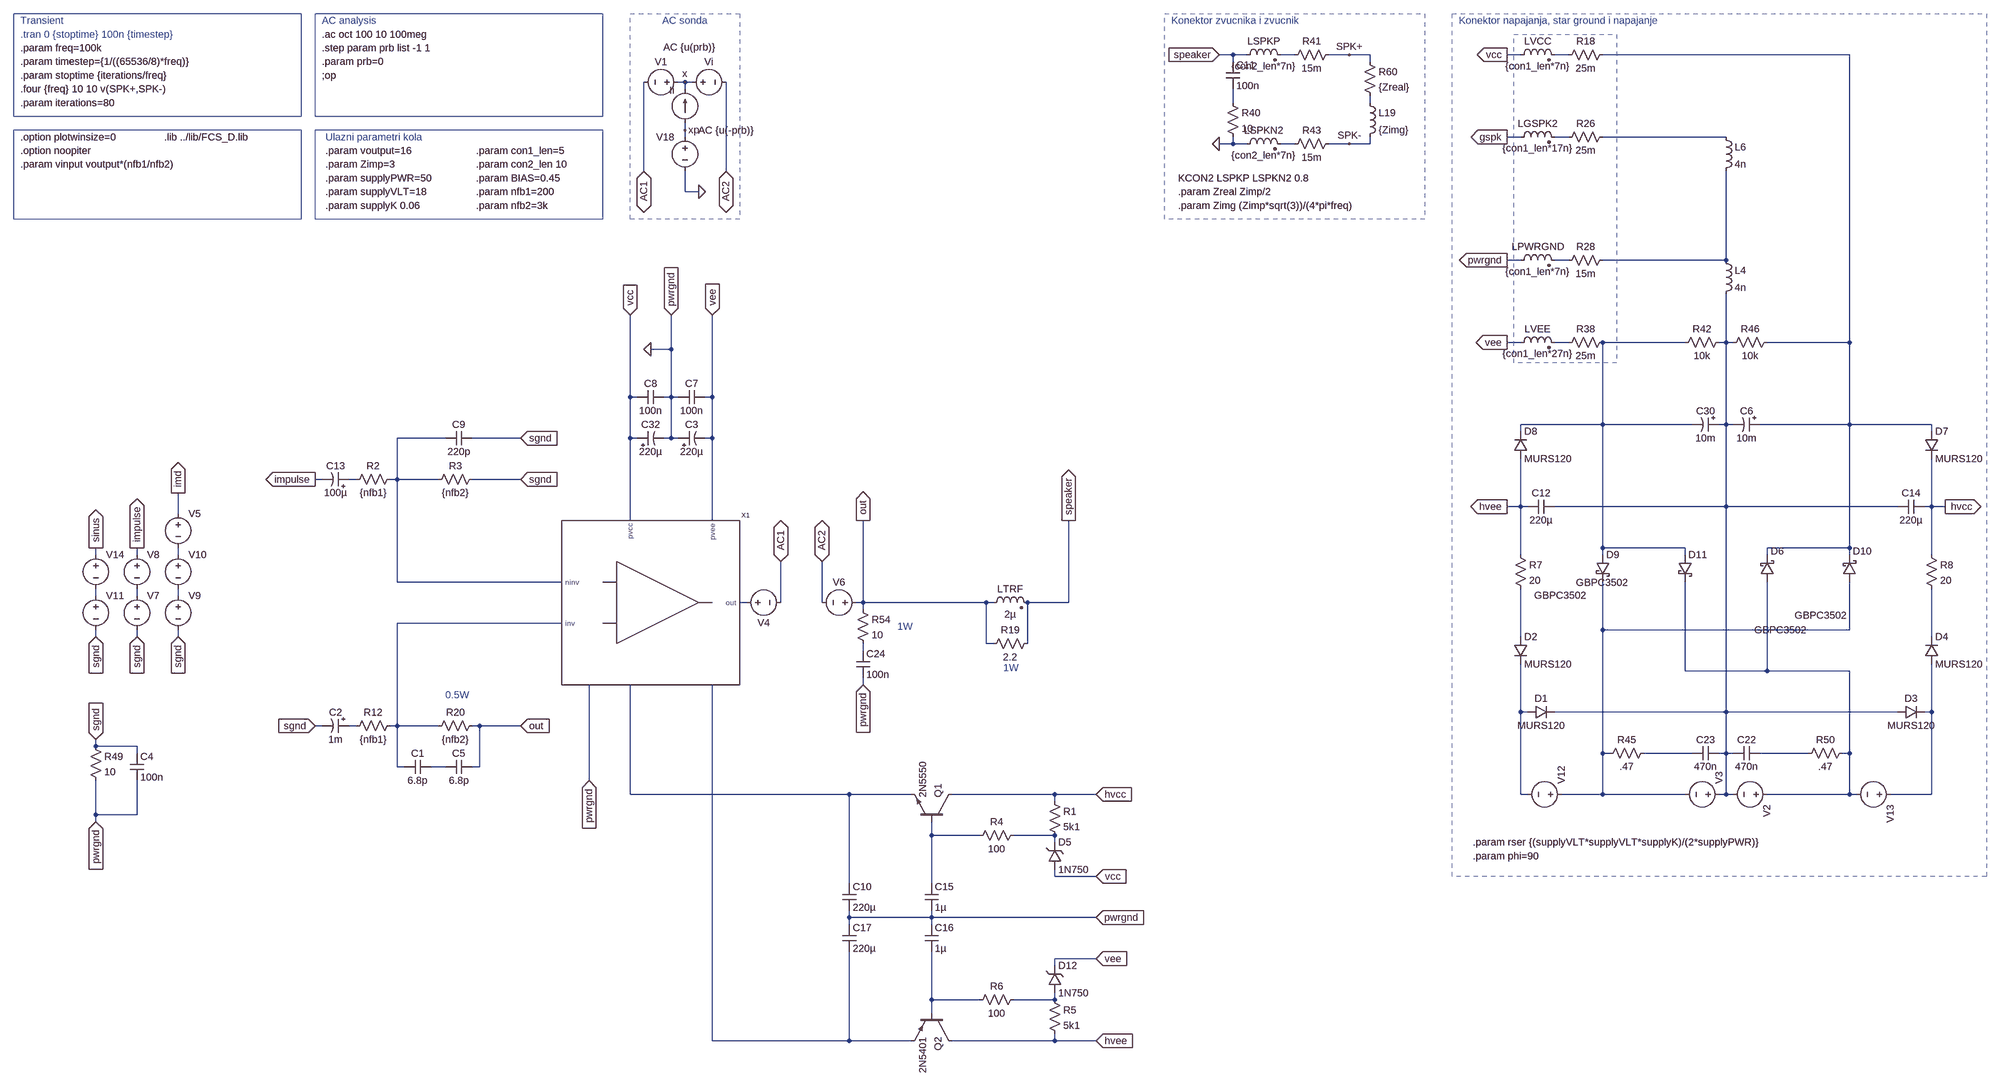
[diagram p0: schematic pab3bbb-compact.asc]
pab3bbb-compact.asc, the LTspice schematic file:
Version 4
SHEET 1 6124 2336
WIRE 2272 -1536 2240 -1536
WIRE 2304 -1536 2272 -1536
WIRE 2416 -1536 2384 -1536
WIRE 2544 -1536 2496 -1536
WIRE 2592 -1536 2544 -1536
WIRE 2944 -1536 2912 -1536
WIRE 3056 -1536 3024 -1536
WIRE 3712 -1536 3136 -1536
WIRE 2272 -1520 2272 -1536
WIRE 2592 -1520 2592 -1536
WIRE 992 -1472 976 -1472
WIRE 1008 -1472 992 -1472
WIRE 992 -1456 992 -1472
WIRE 2272 -1424 2272 -1456
WIRE 2592 -1424 2592 -1440
WIRE 992 -1360 992 -1376
WIRE 992 -1344 992 -1360
WIRE 2944 -1344 2912 -1344
WIRE 3056 -1344 3024 -1344
WIRE 3424 -1344 3136 -1344
WIRE 2272 -1328 2272 -1344
WIRE 2272 -1328 2240 -1328
WIRE 2304 -1328 2272 -1328
WIRE 2416 -1328 2384 -1328
WIRE 2544 -1328 2496 -1328
WIRE 2592 -1328 2592 -1344
WIRE 2592 -1328 2544 -1328
WIRE 896 -1264 896 -1472
WIRE 1088 -1264 1088 -1472
WIRE 992 -1216 992 -1264
WIRE 1024 -1216 992 -1216
WIRE 2944 -1056 2912 -1056
WIRE 3056 -1056 3024 -1056
WIRE 3424 -1056 3424 -1264
WIRE 3424 -1056 3136 -1056
WIRE 2944 -864 2912 -864
WIRE 3056 -864 3024 -864
WIRE 3328 -864 3136 -864
WIRE 3424 -864 3424 -976
WIRE 3424 -864 3408 -864
WIRE 3440 -864 3424 -864
WIRE 3712 -864 3712 -1536
WIRE 3712 -864 3520 -864
WIRE 960 -848 960 -928
WIRE 960 -848 912 -848
WIRE 864 -736 864 -928
WIRE 880 -736 864 -736
WIRE 960 -736 960 -848
WIRE 960 -736 944 -736
WIRE 976 -736 960 -736
WIRE 1056 -736 1056 -928
WIRE 1056 -736 1040 -736
WIRE 3136 -672 3136 -864
WIRE 3136 -672 2944 -672
WIRE 3344 -672 3136 -672
WIRE 3424 -672 3424 -864
WIRE 3424 -672 3408 -672
WIRE 3440 -672 3424 -672
WIRE 3712 -672 3712 -864
WIRE 3712 -672 3504 -672
WIRE 3904 -672 3712 -672
WIRE 2944 -656 2944 -672
WIRE 3904 -656 3904 -672
WIRE 432 -640 320 -640
WIRE 608 -640 496 -640
WIRE 864 -640 864 -736
WIRE 880 -640 864 -640
WIRE 960 -640 960 -736
WIRE 960 -640 944 -640
WIRE 976 -640 960 -640
WIRE 1056 -640 1056 -736
WIRE 1056 -640 1040 -640
WIRE 144 -544 128 -544
WIRE 224 -544 208 -544
WIRE 320 -544 320 -640
WIRE 320 -544 304 -544
WIRE 416 -544 320 -544
WIRE 608 -544 496 -544
WIRE 2944 -480 2944 -592
WIRE 2944 -480 2912 -480
WIRE 2960 -480 2944 -480
WIRE 3424 -480 3424 -672
WIRE 3424 -480 3024 -480
WIRE 3824 -480 3424 -480
WIRE 3904 -480 3904 -592
WIRE 3904 -480 3888 -480
WIRE 3936 -480 3904 -480
WIRE -192 -464 -192 -512
WIRE 864 -448 864 -640
WIRE 1056 -448 1056 -640
WIRE 3136 -384 3136 -672
WIRE 3328 -384 3136 -384
WIRE 3712 -384 3712 -672
WIRE 3712 -384 3520 -384
WIRE -384 -368 -384 -384
WIRE -288 -368 -288 -384
WIRE -192 -368 -192 -384
WIRE 2944 -368 2944 -480
WIRE 3136 -368 3136 -384
WIRE 3328 -368 3328 -384
WIRE 3520 -368 3520 -384
WIRE 3712 -368 3712 -384
WIRE 3904 -368 3904 -480
WIRE 320 -304 320 -544
WIRE 704 -304 320 -304
WIRE -384 -272 -384 -288
WIRE -288 -272 -288 -288
WIRE -192 -272 -192 -288
WIRE 1136 -256 1120 -256
WIRE 1216 -256 1216 -352
WIRE 1312 -256 1312 -352
WIRE 1408 -256 1408 -448
WIRE 1408 -256 1392 -256
WIRE 1696 -256 1408 -256
WIRE 1712 -256 1696 -256
WIRE 1888 -256 1888 -448
WIRE 1888 -256 1792 -256
WIRE 1408 -240 1408 -256
WIRE 704 -208 320 -208
WIRE 3136 -192 3136 -304
WIRE 3712 -192 3712 -304
WIRE 3712 -192 3136 -192
WIRE -384 -176 -384 -192
WIRE -288 -176 -288 -192
WIRE -192 -176 -192 -192
WIRE 2944 -176 2944 -288
WIRE 3904 -176 3904 -288
WIRE 1696 -160 1696 -256
WIRE 1712 -160 1696 -160
WIRE 1792 -160 1792 -256
WIRE 1408 -144 1408 -160
WIRE 3328 -96 3328 -304
WIRE 3520 -96 3520 -304
WIRE 3520 -96 3328 -96
WIRE 3712 -96 3520 -96
WIRE 1408 -64 1408 -80
WIRE 2944 0 2944 -112
WIRE 2960 0 2944 0
WIRE 3424 0 3424 -480
WIRE 3424 0 3024 0
WIRE 3824 0 3424 0
WIRE 3904 0 3904 -112
WIRE 3904 0 3888 0
WIRE 144 32 128 32
WIRE 224 32 208 32
WIRE 320 32 320 -208
WIRE 320 32 304 32
WIRE 416 32 320 32
WIRE 512 32 496 32
WIRE 608 32 512 32
WIRE -384 80 -384 64
WIRE -288 80 -384 80
WIRE -288 96 -288 80
WIRE 3136 96 3136 -192
WIRE 3152 96 3136 96
WIRE 3344 96 3232 96
WIRE 3424 96 3424 0
WIRE 3424 96 3408 96
WIRE 3440 96 3424 96
WIRE 3616 96 3504 96
WIRE 3712 96 3712 -96
WIRE 3712 96 3696 96
WIRE 320 128 320 32
WIRE 336 128 320 128
WIRE 432 128 400 128
WIRE 512 128 512 32
WIRE 512 128 496 128
WIRE 768 160 768 -64
WIRE 864 192 864 -64
WIRE 1376 192 864 192
WIRE 1520 192 1376 192
WIRE 1856 192 1616 192
WIRE 1952 192 1856 192
WIRE 2944 192 2944 0
WIRE 2960 192 2944 192
WIRE 3136 192 3136 96
WIRE 3136 192 3040 192
WIRE 3328 192 3136 192
WIRE 3424 192 3424 96
WIRE 3424 192 3408 192
WIRE 3440 192 3424 192
WIRE 3712 192 3712 96
WIRE 3712 192 3520 192
WIRE 3728 192 3712 192
WIRE 3904 192 3904 0
WIRE 3904 192 3808 192
WIRE 1856 208 1856 192
WIRE -384 240 -384 160
WIRE -288 240 -288 160
WIRE -288 240 -384 240
WIRE -384 256 -384 240
WIRE 1568 288 1568 256
WIRE 1680 288 1568 288
WIRE 1856 288 1760 288
WIRE 1856 304 1856 288
WIRE 1856 384 1856 368
WIRE 1952 384 1856 384
WIRE 1376 400 1376 192
WIRE 1568 400 1568 288
WIRE 1376 480 1376 464
WIRE 1568 480 1568 464
WIRE 1568 480 1376 480
WIRE 1952 480 1568 480
WIRE 1376 496 1376 480
WIRE 1568 496 1568 480
WIRE 1952 576 1856 576
WIRE 1856 592 1856 576
WIRE 1568 672 1568 560
WIRE 1680 672 1568 672
WIRE 1856 672 1856 656
WIRE 1856 672 1760 672
WIRE 1568 704 1568 672
WIRE 1056 768 1056 -64
WIRE 1376 768 1376 560
WIRE 1376 768 1056 768
WIRE 1520 768 1376 768
WIRE 1856 768 1856 752
WIRE 1856 768 1616 768
WIRE 1952 768 1856 768
FLAG 992 -1472 x
FLAG 1408 -448 out
IOPIN 1408 -448 Out
FLAG 992 -1360 xp
FLAG 1408 -64 pwrgnd
IOPIN 1408 -64 In
FLAG 128 32 sgnd
IOPIN 128 32 In
FLAG -384 -176 sgnd
IOPIN -384 -176 In
FLAG -384 -384 sinus
IOPIN -384 -384 Out
FLAG 2912 -1536 vcc
IOPIN 2912 -1536 Out
FLAG 2912 -864 vee
IOPIN 2912 -864 Out
FLAG 2912 -1344 gspk
IOPIN 2912 -1344 Out
FLAG 2912 -1056 pwrgnd
IOPIN 2912 -1056 Out
FLAG 608 32 out
IOPIN 608 32 In
FLAG 1888 -448 speaker
IOPIN 1888 -448 Out
FLAG 2240 -1536 speaker
IOPIN 2240 -1536 In
FLAG -288 -384 impulse
IOPIN -288 -384 Out
FLAG 896 -1264 AC1
IOPIN 896 -1264 BiDir
FLAG 1088 -1264 AC2
IOPIN 1088 -1264 BiDir
FLAG 1216 -352 AC1
IOPIN 1216 -352 BiDir
FLAG 1312 -352 AC2
IOPIN 1312 -352 BiDir
FLAG 2544 -1536 SPK+
FLAG 2544 -1328 SPK-
FLAG -192 -512 imd
IOPIN -192 -512 Out
FLAG -288 -176 sgnd
IOPIN -288 -176 In
FLAG -192 -176 sgnd
IOPIN -192 -176 In
FLAG -384 64 sgnd
IOPIN -384 64 In
FLAG 1056 -928 vee
IOPIN 1056 -928 In
FLAG 864 -928 vcc
IOPIN 864 -928 In
FLAG 960 -928 pwrgnd
IOPIN 960 -928 In
FLAG 1024 -1216 0
FLAG 768 160 pwrgnd
IOPIN 768 160 In
FLAG -384 256 pwrgnd
IOPIN -384 256 In
FLAG 912 -848 0
FLAG 608 -544 sgnd
IOPIN 608 -544 In
FLAG 2240 -1328 0
FLAG 608 -640 sgnd
IOPIN 608 -640 In
FLAG 2912 -480 hvee
IOPIN 2912 -480 Out
FLAG 3936 -480 hvcc
IOPIN 3936 -480 Out
FLAG 1952 192 hvcc
IOPIN 1952 192 In
FLAG 1952 384 vcc
IOPIN 1952 384 In
FLAG 1952 480 pwrgnd
IOPIN 1952 480 In
FLAG 1952 576 vee
IOPIN 1952 576 In
FLAG 1952 768 hvee
IOPIN 1952 768 In
FLAG 128 -544 impulse
IOPIN 128 -544 Out
SYMBOL res 320 16 R90
WINDOW 0 0 56 VBottom 2
WINDOW 3 32 56 VTop 2
SYMATTR InstName R12
SYMATTR Value {nfb1}
SYMBOL voltage 3536 192 R90
WINDOW 123 0 0 Left 2
WINDOW 3 -94 177 Invisible 2
SYMATTR Value SINE(0 {supplyVLT*sqrt(2)} 50 1m 0 {phi})
SYMATTR SpiceLine Rser={rser}
SYMATTR InstName V2
SYMBOL current 992 -1376 R180
WINDOW 0 24 77 Left 2
WINDOW 3 24 0 Invisible 2
WINDOW 123 -71 178 Left 2
WINDOW 39 0 0 Left 2
SYMATTR InstName Ii
SYMATTR Value 0
SYMATTR Value2 AC {u(prb)}
SYMBOL voltage 992 -1472 R270
WINDOW 0 32 56 VTop 2
WINDOW 3 -32 56 Invisible 2
WINDOW 123 -97 96 VBottom 2
WINDOW 39 -32 56 VBottom 2
SYMATTR InstName Vi
SYMATTR Value 0
SYMATTR Value2 AC {u(-prb)}
SYMBOL ind2 1696 -240 R270
WINDOW 0 32 56 VTop 2
WINDOW 3 4 56 VBottom 2
SYMATTR InstName LTRF
SYMATTR Value 2µ
SYMATTR SpiceLine Rser=10m Rpar=3meg Cpar=1p
SYMATTR Type ind
SYMBOL res 1696 -144 R270
WINDOW 0 32 56 VTop 2
WINDOW 3 0 56 VBottom 2
SYMATTR InstName R19
SYMATTR Value 2.2
SYMBOL res 512 16 R90
WINDOW 0 0 56 VBottom 2
WINDOW 3 32 56 VTop 2
SYMATTR InstName R20
SYMATTR Value {nfb2}
SYMBOL voltage 992 -1472 R90
WINDOW 0 -32 56 VBottom 2
WINDOW 3 32 56 Invisible 2
WINDOW 123 0 0 Left 2
WINDOW 39 0 0 Left 2
SYMATTR InstName V1
SYMATTR Value 0
SYMBOL schottky 3504 -304 M180
WINDOW 0 24 72 Left 2
WINDOW 3 -14 -112 Left 2
SYMATTR InstName D6
SYMATTR Value GBPC3502
SYMATTR Description Diode
SYMATTR Type diode
SYMBOL schottky 3120 -368 R0
WINDOW 3 -144 95 Left 2
SYMATTR Value GBPC3502
SYMATTR InstName D9
SYMATTR Description Diode
SYMATTR Type diode
SYMBOL voltage 3424 192 M270
WINDOW 123 0 0 Left 2
WINDOW 3 -96 -62 Invisible 2
SYMATTR Value SINE(0 {supplyVLT*sqrt(2)} 50 1m 0 {phi})
SYMATTR SpiceLine Rser={rser}
SYMATTR InstName V3
SYMBOL res 1392 -256 R0
SYMATTR InstName R54
SYMATTR Value 10
SYMBOL res 2576 -1536 R0
SYMATTR InstName R60
SYMATTR Value {Zreal}
SYMBOL ind 2576 -1440 R0
SYMATTR InstName L19
SYMATTR Value {Zimg}
SYMATTR SpiceLine Cpar=10p
SYMBOL voltage 992 -1360 M0
WINDOW 123 0 0 Left 2
WINDOW 39 0 0 Left 2
WINDOW 3 24 96 Invisible 2
SYMATTR Value 0
SYMATTR InstName V18
SYMBOL cap 1392 -144 R0
SYMATTR InstName C24
SYMATTR Value 100n
SYMATTR SpiceLine Rser=700m Lser=7n Rpar=4.4meg Cpar=1p
SYMBOL polcap 208 16 R90
WINDOW 0 0 32 VBottom 2
WINDOW 3 32 32 VTop 2
SYMATTR InstName C2
SYMATTR Value 1m
SYMATTR SpiceLine V=6.3 Irms=1.44 Rser=0.09 Lser=5.5n Rpar=1110k Cpar=3p
SYMATTR Description Capacitor
SYMATTR Type cap
SYMBOL schottky 3696 -304 M180
WINDOW 0 24 72 Left 2
WINDOW 3 -112 -78 Left 2
SYMATTR InstName D10
SYMATTR Value GBPC3502
SYMATTR Description Diode
SYMATTR Type diode
SYMBOL schottky 3312 -368 R0
WINDOW 3 -239 65 Left 2
SYMATTR Value GBPC3502
SYMATTR InstName D11
SYMATTR Description Diode
SYMATTR Type diode
SYMBOL ind2 2928 -1520 R270
WINDOW 0 32 56 VTop 2
WINDOW 3 5 56 VBottom 2
SYMATTR InstName LVCC
SYMATTR Value {con1_len*7n}
SYMATTR SpiceLine Rser={con1_len*.5m}
SYMATTR Type ind
SYMBOL ind2 2928 -848 R270
WINDOW 0 32 56 VTop 2
WINDOW 3 5 56 VBottom 2
SYMATTR InstName LVEE
SYMATTR Value {con1_len*27n}
SYMATTR SpiceLine Rser={con1_len*.5m}
SYMATTR Type ind
SYMBOL voltage -384 -288 R0
WINDOW 123 24 44 Left 2
WINDOW 39 0 0 Left 2
WINDOW 3 24 96 Invisible 2
SYMATTR Value SINE(0 {vinput} {freq} 10m 10 0 5)
SYMATTR InstName V11
SYMBOL ind2 2928 -1328 R270
WINDOW 0 32 56 VTop 2
WINDOW 3 5 56 VBottom 2
SYMATTR InstName LGSPK2
SYMATTR Value {con1_len*17n}
SYMATTR SpiceLine Rser={con1_len*.5m}
SYMATTR Type ind
SYMBOL res 3152 -1552 R90
WINDOW 0 0 56 VBottom 2
WINDOW 3 32 56 VTop 2
SYMATTR InstName R18
SYMATTR Value 25m
SYMBOL res 3152 -1360 R90
WINDOW 0 0 56 VBottom 2
WINDOW 3 32 56 VTop 2
SYMATTR InstName R26
SYMATTR Value 25m
SYMBOL res 3152 -1072 R90
WINDOW 0 0 56 VBottom 2
WINDOW 3 32 56 VTop 2
SYMATTR InstName R28
SYMATTR Value 15m
SYMBOL res 3152 -880 R90
WINDOW 0 0 56 VBottom 2
WINDOW 3 32 56 VTop 2
SYMATTR InstName R38
SYMATTR Value 25m
SYMBOL ind 3408 -1072 R0
SYMATTR InstName L4
SYMATTR Value 4n
SYMATTR SpiceLine Rser=1m
SYMBOL ind 3408 -1360 R0
SYMATTR InstName L6
SYMATTR Value 4n
SYMATTR SpiceLine Rser=1m
SYMBOL ind2 2288 -1520 R270
WINDOW 0 32 56 VTop 2
WINDOW 3 5 56 VBottom 2
SYMATTR InstName LSPKP
SYMATTR Value {con2_len*7n}
SYMATTR SpiceLine Rser={con2_len*.5m}
SYMATTR Type ind
SYMBOL ind2 2288 -1312 R270
WINDOW 0 32 56 VTop 2
WINDOW 3 5 56 VBottom 2
SYMATTR InstName LSPKN2
SYMATTR Value {con2_len*7n}
SYMATTR SpiceLine Rser={con2_len*.5m}
SYMATTR Type ind
SYMBOL res 2512 -1552 R90
WINDOW 0 0 56 VBottom 2
WINDOW 3 32 56 VTop 2
SYMATTR InstName R41
SYMATTR Value 15m
SYMBOL res 2512 -1344 R90
WINDOW 0 0 56 VBottom 2
WINDOW 3 32 56 VTop 2
SYMATTR InstName R43
SYMATTR Value 15m
SYMBOL voltage -288 -288 R0
WINDOW 3 24 96 Invisible 2
WINDOW 123 0 0 Left 2
WINDOW 39 0 0 Left 2
SYMATTR Value PULSE(0 {vinput} 1u 1n 1n {1/(freq*2)} {1/freq})
SYMATTR InstName V7
SYMBOL voltage -288 -384 R0
WINDOW 3 24 96 Invisible 2
WINDOW 123 0 0 Left 2
WINDOW 39 0 0 Left 2
SYMATTR Value PULSE(0 {-vinput} {1u+(1/(freq*2))} 1n 1n {1/(freq*2)} {1/freq})
SYMATTR InstName V8
SYMBOL voltage 1120 -256 R270
WINDOW 0 -32 56 VBottom 2
WINDOW 3 32 56 Invisible 2
WINDOW 123 0 0 Left 2
WINDOW 39 0 0 Left 2
SYMATTR InstName V4
SYMATTR Value 0
SYMBOL voltage 1408 -256 R90
WINDOW 0 -32 56 VBottom 2
WINDOW 3 32 56 Invisible 2
WINDOW 123 0 0 Left 2
WINDOW 39 0 0 Left 2
SYMATTR InstName V6
SYMATTR Value 0
SYMBOL voltage -192 -288 R0
WINDOW 3 24 96 Invisible 2
WINDOW 123 0 0 Left 2
WINDOW 39 0 0 Left 2
SYMATTR Value SINE(0 {vinput/3} 19k)
SYMATTR InstName V9
SYMBOL voltage -192 -384 R0
WINDOW 3 24 96 Invisible 2
WINDOW 123 0 0 Left 2
WINDOW 39 0 0 Left 2
SYMATTR Value SINE(0 {vinput/3} 20k 0 0)
SYMATTR InstName V10
SYMBOL cap 3440 80 M90
WINDOW 0 0 32 VBottom 2
WINDOW 3 32 32 VTop 2
SYMATTR InstName C22
SYMATTR Value 470n
SYMATTR SpiceLine Rser=700m Lser=7n Rpar=4.4meg Cpar=1p
SYMBOL cap 3344 80 M90
WINDOW 0 0 32 VBottom 2
WINDOW 3 32 32 VTop 2
SYMATTR InstName C23
SYMATTR Value 470n
SYMATTR SpiceLine Rser=700m Lser=7n Rpar=4.4meg Cpar=1p
SYMBOL polcap 3408 -688 R90
WINDOW 0 0 32 VBottom 2
WINDOW 3 32 32 VTop 2
SYMATTR InstName C30
SYMATTR Value 10m
SYMATTR SpiceLine V=50 Irms=2.5 Rser=0.055 Lser=20n Rpar=40k Cpar=3p
SYMATTR Description Capacitor
SYMATTR Type cap
SYMBOL polcap 3504 -688 R90
WINDOW 0 0 32 VBottom 2
WINDOW 3 32 32 VTop 2
SYMATTR InstName C6
SYMATTR Value 10m
SYMATTR SpiceLine V=50 Irms=2.5 Rser=0.055 Lser=20n Rpar=40k Cpar=3p
SYMATTR Description Capacitor
SYMATTR Type cap
SYMBOL res 3424 -880 R90
WINDOW 0 0 56 VBottom 2
WINDOW 3 32 56 VTop 2
SYMATTR InstName R42
SYMATTR Value 10k
SYMBOL res 3536 -880 R90
WINDOW 0 0 56 VBottom 2
WINDOW 3 32 56 VTop 2
SYMATTR InstName R46
SYMATTR Value 10k
SYMBOL polcap 880 -624 R270
WINDOW 0 32 32 VTop 2
WINDOW 3 0 32 VBottom 2
SYMATTR InstName C32
SYMATTR Value 220µ
SYMATTR SpiceLine V=63 Irms=2.77 Rser=0.070 Lser=4n Rpar=1900k Cpar=3p
SYMATTR Description Capacitor
SYMATTR Type cap
SYMBOL res -400 64 R0
SYMATTR InstName R49
SYMATTR Value 10
SYMBOL cap 2256 -1520 R0
SYMATTR InstName C11
SYMATTR Value 100n
SYMBOL res 2256 -1440 R0
SYMATTR InstName R40
SYMATTR Value 10
SYMBOL res 3248 80 R90
WINDOW 0 0 56 VBottom 2
WINDOW 3 32 56 VTop 2
SYMATTR InstName R45
SYMATTR Value .47
SYMBOL res 3712 80 R90
WINDOW 0 0 56 VBottom 2
WINDOW 3 32 56 VTop 2
SYMATTR InstName R50
SYMATTR Value .47
SYMBOL pab3bbb-compact-module 912 -256 R0
SYMATTR InstName X1
SYMBOL res 320 -560 R90
WINDOW 0 0 56 VBottom 2
WINDOW 3 32 56 VTop 2
SYMATTR InstName R2
SYMATTR Value {nfb1}
SYMBOL res 512 -560 R90
WINDOW 0 0 56 VBottom 2
WINDOW 3 32 56 VTop 2
SYMATTR InstName R3
SYMATTR Value {nfb2}
SYMBOL polcap 208 -528 M270
WINDOW 0 32 32 VTop 2
WINDOW 3 0 32 VBottom 2
SYMATTR InstName C13
SYMATTR Value 100µ
SYMATTR SpiceLine V=6.3 Irms=1.44 Rser=0.09 Lser=5.5n Rpar=1110k Cpar=3p
SYMATTR Description Capacitor
SYMATTR Type cap
SYMBOL cap 1040 -752 R90
WINDOW 0 0 32 VBottom 2
WINDOW 3 32 32 VTop 2
SYMATTR InstName C7
SYMATTR Value 100n
SYMATTR SpiceLine Rser=700m Lser=7n Rpar=4.4meg Cpar=1p
SYMBOL cap 944 -752 R90
WINDOW 0 0 32 VBottom 2
WINDOW 3 32 32 VTop 2
SYMATTR InstName C8
SYMATTR Value 100n
SYMATTR SpiceLine Rser=700m Lser=7n Rpar=4.4meg Cpar=1p
SYMBOL voltage -192 -480 R0
WINDOW 3 24 96 Invisible 2
WINDOW 123 0 0 Left 2
WINDOW 39 0 0 Left 2
SYMATTR Value SINE(0 {vinput/3} 60 0 0)
SYMATTR InstName V5
SYMBOL ind2 2928 -1040 R270
WINDOW 0 32 56 VTop 2
WINDOW 3 5 56 VBottom 2
SYMATTR InstName LPWRGND
SYMATTR Value {con1_len*7n}
SYMATTR SpiceLine Rser={con1_len*.5m}
SYMATTR Type ind
SYMBOL polcap 976 -624 R270
WINDOW 0 32 32 VTop 2
WINDOW 3 0 32 VBottom 2
SYMATTR InstName C3
SYMATTR Value 220µ
SYMATTR SpiceLine V=63 Irms=2.77 Rser=0.070 Lser=4n Rpar=1900k Cpar=3p
SYMATTR Description Capacitor
SYMATTR Type cap
SYMBOL cap -304 96 R0
SYMATTR InstName C4
SYMATTR Value 100n
SYMATTR SpiceLine Rser=700m Lser=7n Rpar=4.4meg Cpar=1p
SYMBOL cap 400 112 R90
WINDOW 0 0 32 VBottom 2
WINDOW 3 32 32 VTop 2
SYMATTR InstName C1
SYMATTR Value 6.8p
SYMBOL cap 496 112 R90
WINDOW 0 0 32 VBottom 2
WINDOW 3 32 32 VTop 2
SYMATTR InstName C5
SYMATTR Value 6.8p
SYMBOL cap 496 -656 R90
WINDOW 0 0 32 VBottom 2
WINDOW 3 32 32 VTop 2
SYMATTR InstName C9
SYMATTR Value 220p
SYMBOL diode 2960 16 R270
WINDOW 0 32 32 VTop 2
WINDOW 3 0 32 VBottom 2
SYMATTR InstName D1
SYMATTR Value MURS120
SYMBOL diode 2928 -176 R0
SYMATTR InstName D2
SYMATTR Value MURS120
SYMBOL cap 3024 -496 R90
WINDOW 0 0 32 VBottom 2
WINDOW 3 32 32 VTop 2
SYMATTR InstName C12
SYMATTR Value 220µ
SYMBOL diode 3824 16 R270
WINDOW 0 32 32 VTop 2
WINDOW 3 0 32 VBottom 2
SYMATTR InstName D3
SYMATTR Value MURS120
SYMBOL diode 3888 -112 M180
WINDOW 0 24 64 Left 2
WINDOW 3 24 0 Left 2
SYMATTR InstName D4
SYMATTR Value MURS120
SYMBOL cap 3888 -496 R90
WINDOW 0 0 32 VBottom 2
WINDOW 3 32 32 VTop 2
SYMATTR InstName C14
SYMATTR Value 220µ
SYMBOL npn 1616 256 M270
SYMATTR InstName Q1
SYMATTR Value 2N5550
SYMBOL res 1840 192 R0
SYMATTR InstName R1
SYMATTR Value 5k1
SYMBOL zener 1840 368 M180
WINDOW 0 24 64 Left 2
WINDOW 3 24 0 Left 2
SYMATTR InstName D5
SYMATTR Value 1N750
SYMATTR Description Diode
SYMATTR Type diode
SYMBOL cap 1552 400 R0
SYMATTR InstName C15
SYMATTR Value 1µ
SYMBOL res 1776 272 R90
WINDOW 0 0 56 VBottom 2
WINDOW 3 32 56 VTop 2
SYMATTR InstName R4
SYMATTR Value 100
SYMBOL diode 3888 -656 R0
SYMATTR InstName D7
SYMATTR Value MURS120
SYMBOL diode 2928 -592 M180
WINDOW 0 24 64 Left 2
WINDOW 3 24 0 Left 2
SYMATTR InstName D8
SYMATTR Value MURS120
SYMBOL pnp 1616 704 R90
SYMATTR InstName Q2
SYMATTR Value 2N5401
SYMBOL cap 1552 496 R0
SYMATTR InstName C16
SYMATTR Value 1µ
SYMBOL zener 1840 656 M180
WINDOW 0 24 64 Left 2
WINDOW 3 24 0 Left 2
SYMATTR InstName D12
SYMATTR Value 1N750
SYMATTR Description Diode
SYMATTR Type diode
SYMBOL res 1840 656 R0
SYMATTR InstName R5
SYMATTR Value 5k1
SYMBOL res 1776 656 R90
WINDOW 0 0 56 VBottom 2
WINDOW 3 32 56 VTop 2
SYMATTR InstName R6
SYMATTR Value 100
SYMBOL voltage 3056 192 M270
WINDOW 123 0 0 Left 2
WINDOW 3 -96 -62 Invisible 2
SYMATTR Value SINE(0 {supplyVLT*sqrt(2)} 50 1m 0 {phi})
SYMATTR SpiceLine Rser={rser+14}
SYMATTR InstName V12
SYMBOL voltage 3824 192 R90
WINDOW 123 0 0 Left 2
WINDOW 3 -94 177 Invisible 2
SYMATTR Value SINE(0 {supplyVLT*sqrt(2)} 50 1m 0 {phi})
SYMATTR SpiceLine Rser={rser+14}
SYMATTR InstName V13
SYMBOL cap 1360 400 R0
SYMATTR InstName C10
SYMATTR Value 220µ
SYMBOL cap 1360 496 R0
SYMATTR InstName C17
SYMATTR Value 220µ
SYMBOL voltage -384 -384 R0
WINDOW 123 24 44 Left 2
WINDOW 39 0 0 Left 2
WINDOW 3 24 96 Invisible 2
SYMATTR Value SINE(0 {vinput} {freq} 310m 10 0 5)
SYMATTR InstName V14
SYMBOL res 2928 -384 R0
SYMATTR InstName R7
SYMATTR Value 20
SYMBOL res 3888 -384 R0
SYMATTR InstName R8
SYMATTR Value 20
TEXT 144 -1488 Left 2 !;op
TEXT -560 -1344 Left 2 !.option plotwinsize=0
TEXT -560 -1312 Left 2 !.option noopiter
TEXT -560 -1616 Left 2 ;Transient
TEXT -560 -1456 Left 2 !.four {freq} 10 10 v(SPK+,SPK-)
TEXT 144 -1520 Left 2 !.param prb=0
TEXT -560 -1520 Left 2 !.param timestep={1/((65536/8)*freq)}
TEXT -560 -1552 Left 2 !.param freq=100k
TEXT -560 -1488 Left 2 !.param stoptime {iterations/freq}
TEXT 144 -1584 Left 2 !.ac oct 100 10 100meg
TEXT 144 -1552 Left 2 !.step param prb list -1 1
TEXT 144 -1616 Left 2 ;AC analysis
TEXT -560 -1424 Left 2 !.param iterations=80
TEXT 152 -1280 Left 2 !.param Zimp=3
TEXT 2144 -1216 Left 2 !.param Zreal Zimp/2
TEXT 2144 -1184 Left 2 !.param Zimg (Zimp*sqrt(3))/(4*pi*freq)
TEXT 152 -1248 Left 2 !.param supplyPWR=50
TEXT 152 -1216 Left 2 !.param supplyVLT=18
TEXT 152 -1312 Left 2 !.param voutput=16
TEXT 152 -1184 Left 2 !.param supplyK 0.06
TEXT 2832 304 Left 2 !.param rser {(supplyVLT*supplyVLT*supplyK)/(2*supplyPWR)}
TEXT -560 -1584 Left 2 ;.tran 0 {stoptime} 100n {timestep}
TEXT 2832 336 Left 2 !.param phi=90
TEXT 504 -1312 Left 2 !.param con1_len=5
TEXT 504 -1280 Left 2 !.param con2_len 10
TEXT 2144 -1248 Left 2 !KCON2 LSPKP LSPKN2 0.8
TEXT 2128 -1616 Left 2 ;Konektor zvucnika i zvucnik
TEXT 2800 -1616 Left 2 ;Konektor napajanja, star ground i napajanje
TEXT 152 -1344 Left 2 ;Ulazni parametri kola
TEXT 992 -1616 Center 2 ;AC sonda
TEXT -224 -1344 Left 2 !.lib ../lib/FCS_D.lib
TEXT 504 -1248 Left 2 !.param BIAS=0.45
TEXT -560 -1280 Left 2 !.param vinput voutput*(nfb1/nfb2)
TEXT 504 -1216 Left 2 !.param nfb1=200
TEXT 504 -1184 Left 2 !.param nfb2=3k
TEXT 432 -40 Left 2 ;0.5W
TEXT 1488 -200 Left 2 ;1W
TEXT 1736 -104 Left 2 ;1W
RECTANGLE Normal 96 -1632 -576 -1392
RECTANGLE Normal 96 -1152 -576 -1360
RECTANGLE Normal 800 -1632 128 -1392
RECTANGLE Normal 2720 -1152 2112 -1632 2
RECTANGLE Normal 1120 -1152 864 -1632 2
RECTANGLE Normal 3168 -816 2928 -1584 2
RECTANGLE Normal 800 -1152 128 -1360
RECTANGLE Normal 4032 384 2784 -1632 2

The netlist it stands for:
* pab3bbb-compact.asc
R12 N021 N029 {nfb1}
V2 N026 N013 SINE(0 {supplyVLT*sqrt(2)} 50 1m 0 {phi}) Rser={rser}
Ii xp x 0 AC {u(prb)}
Vi x AC2 0 AC {u(-prb)}
LTRF out speaker 2µ Rser=10m Rpar=3meg Cpar=1p
R19 out speaker 2.2
R20 out N021 {nfb2}
V1 x AC1 0
D6 N026 N003 GBPC3502
D9 N012 N022 GBPC3502
V3 N013 N022 SINE(0 {supplyVLT*sqrt(2)} 50 1m 0 {phi}) Rser={rser}
R54 out N025 10
R60 SPK+ N005 {Zreal}
L19 N005 SPK- {Zimg} Cpar=10p
V18 xp 0 0
C24 N025 0 100n Rser=700m Lser=7n Rpar=4.4meg Cpar=1p
C2 N029 sgnd 1m V=6.3 Irms=1.44 Rser=0.09 Lser=5.5n Rpar=1110k Cpar=3p
D10 N022 N003 GBPC3502
D11 N012 N026 GBPC3502
LVCC vcc N002 {con1_len*7n} Rser={con1_len*.5m}
LVEE vee N011 {con1_len*27n} Rser={con1_len*.5m}
V11 N017 sgnd SINE(0 {vinput} {freq} 10m 10 0 5)
LGSPK2 gspk N006 {con1_len*17n} Rser={con1_len*.5m}
R18 N003 N002 25m
R26 N007 N006 25m
R28 N010 N009 15m
R38 N012 N011 25m
L4 N010 N013 4n Rser=1m
L6 N007 N010 4n Rser=1m
LSPKP speaker N001 {con2_len*7n} Rser={con2_len*.5m}
LSPKN2 0 N008 {con2_len*7n} Rser={con2_len*.5m}
R41 SPK+ N001 15m
R43 SPK- N008 15m
V7 N018 sgnd PULSE(0 {vinput} 1u 1n 1n {1/(freq*2)} {1/freq})
V8 impulse N018 PULSE(0 {-vinput} {1u+(1/(freq*2))} 1n 1n {1/(freq*2)} {1/freq})
V4 N020 AC1 0
V6 out AC2 0
V9 N019 sgnd SINE(0 {vinput/3} 19k)
V10 N016 N019 SINE(0 {vinput/3} 20k 0 0)
C22 N013 N031 470n Rser=700m Lser=7n Rpar=4.4meg Cpar=1p
C23 N030 N013 470n Rser=700m Lser=7n Rpar=4.4meg Cpar=1p
C30 N013 N012 10m V=50 Irms=2.5 Rser=0.055 Lser=20n Rpar=40k Cpar=3p
C6 N003 N013 10m V=50 Irms=2.5 Rser=0.055 Lser=20n Rpar=40k Cpar=3p
R42 N013 N012 10k
R46 N003 N013 10k
C32 vcc 0 220µ V=63 Irms=2.77 Rser=0.070 Lser=4n Rpar=1900k Cpar=3p
R49 sgnd 0 10
C11 speaker N004 100n
R40 N004 0 10
R45 N030 N022 .47
R50 N026 N031 .47
XX1 N014 N021 N020 vee vcc pab3bbb-compact-module  ; pins ninv inv out pvee pvcc
R2 N014 N015 {nfb1}
R3 sgnd N014 {nfb2}
C13 N015 impulse 100µ V=6.3 Irms=1.44 Rser=0.09 Lser=5.5n Rpar=1110k Cpar=3p
C7 vee 0 100n Rser=700m Lser=7n Rpar=4.4meg Cpar=1p
C8 0 vcc 100n Rser=700m Lser=7n Rpar=4.4meg Cpar=1p
V5 imd N016 SINE(0 {vinput/3} 60 0 0)
LPWRGND 0 N009 {con1_len*7n} Rser={con1_len*.5m}
C3 0 vee 220µ V=63 Irms=2.77 Rser=0.070 Lser=4n Rpar=1900k Cpar=3p
C4 sgnd 0 100n Rser=700m Lser=7n Rpar=4.4meg Cpar=1p
C1 N032 N021 6.8p
C5 out N032 6.8p
C9 sgnd N014 220p
D1 N027 N013 MURS120
D2 N023 N027 MURS120
C12 N013 hvee 220µ
D3 N013 N028 MURS120
D4 N028 N024 MURS120
C14 hvcc N013 220µ
Q1 hvcc N034 N033 0 2N5550
R1 hvcc N035 5k1
D5 vcc N035 1N750
C15 N034 0 1µ
R4 N035 N034 100
D7 N003 hvcc MURS120
D8 hvee N012 MURS120
Q2 hvee N036 N038 0 2N5401
C16 0 N036 1µ
D12 N037 vee 1N750
R5 N037 hvee 5k1
R6 N037 N036 100
V12 N022 N027 SINE(0 {supplyVLT*sqrt(2)} 50 1m 0 {phi}) Rser={rser+14}
V13 N028 N026 SINE(0 {supplyVLT*sqrt(2)} 50 1m 0 {phi}) Rser={rser+14}
C10 N033 0 220µ
C17 0 N038 220µ
V14 sinus N017 SINE(0 {vinput} {freq} 310m 10 0 5)
R7 hvee N023 20
R8 hvcc N024 20
.model D D
.lib standard.dio
.model NPN NPN
.model PNP PNP
.lib standard.bjt
;op
.option plotwinsize=0
.option noopiter
* Transient
.four {freq} 10 10 v(SPK+,SPK-)
.param prb=0
.param timestep={1/((65536/8)*freq)}
.param freq=100k
.param stoptime {iterations/freq}
.ac oct 100 10 100meg
.step param prb list -1 1
* AC analysis
.param iterations=80
.param Zimp=3
.param Zreal Zimp/2
.param Zimg (Zimp*sqrt(3))/(4*pi*freq)
.param supplyPWR=50
.param supplyVLT=18
.param voutput=16
.param supplyK 0.06
.param rser {(supplyVLT*supplyVLT*supplyK)/(2*supplyPWR)}
* .tran 0 {stoptime} 100n {timestep}
.param phi=90
.param con1_len=5
.param con2_len 10
KCON2 LSPKP LSPKN2 0.8
* Konektor zvucnika i zvucnik
* Konektor napajanja, star ground i napajanje
* Ulazni parametri kola
* AC sonda
.lib ../lib/FCS_D.lib
.param BIAS=0.45
.param vinput voutput*(nfb1/nfb2)
.param nfb1=200
.param nfb2=3k
* 0.5W
* 1W
* 1W
.backanno
.end